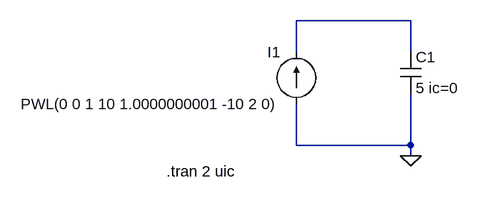
[diagram p0: schematic g4_p2.asc]
g4_p2.asc, the LTspice schematic file:
Version 4
SHEET 1 880 680
WIRE 208 80 32 80
WIRE 32 128 32 80
WIRE 208 128 208 80
WIRE 32 272 32 208
WIRE 208 272 208 192
WIRE 208 272 32 272
WIRE 208 288 208 272
FLAG 208 288 0
SYMBOL cap 192 128 R0
SYMATTR InstName C1
SYMATTR Value 5 ic=0
SYMBOL current 32 208 R180
WINDOW 0 24 80 Left 2
WINDOW 3 24 0 Left 2
WINDOW 123 0 0 Left 0
WINDOW 39 0 0 Left 0
SYMATTR InstName I1
SYMATTR Value PWL(0 0 1 10 1.0000000001 -10 2 0)
TEXT -168 312 Left 2 !.tran 2 uic

The netlist it stands for:
* g4_p2.asc
C1 N001 0 5 ic=0
I1 0 N001 PWL(0 0 1 10 1.0000000001 -10 2 0)
.tran 2 uic
.backanno
.end